# Altium schematic sheet AD9834.SchDoc
size A4
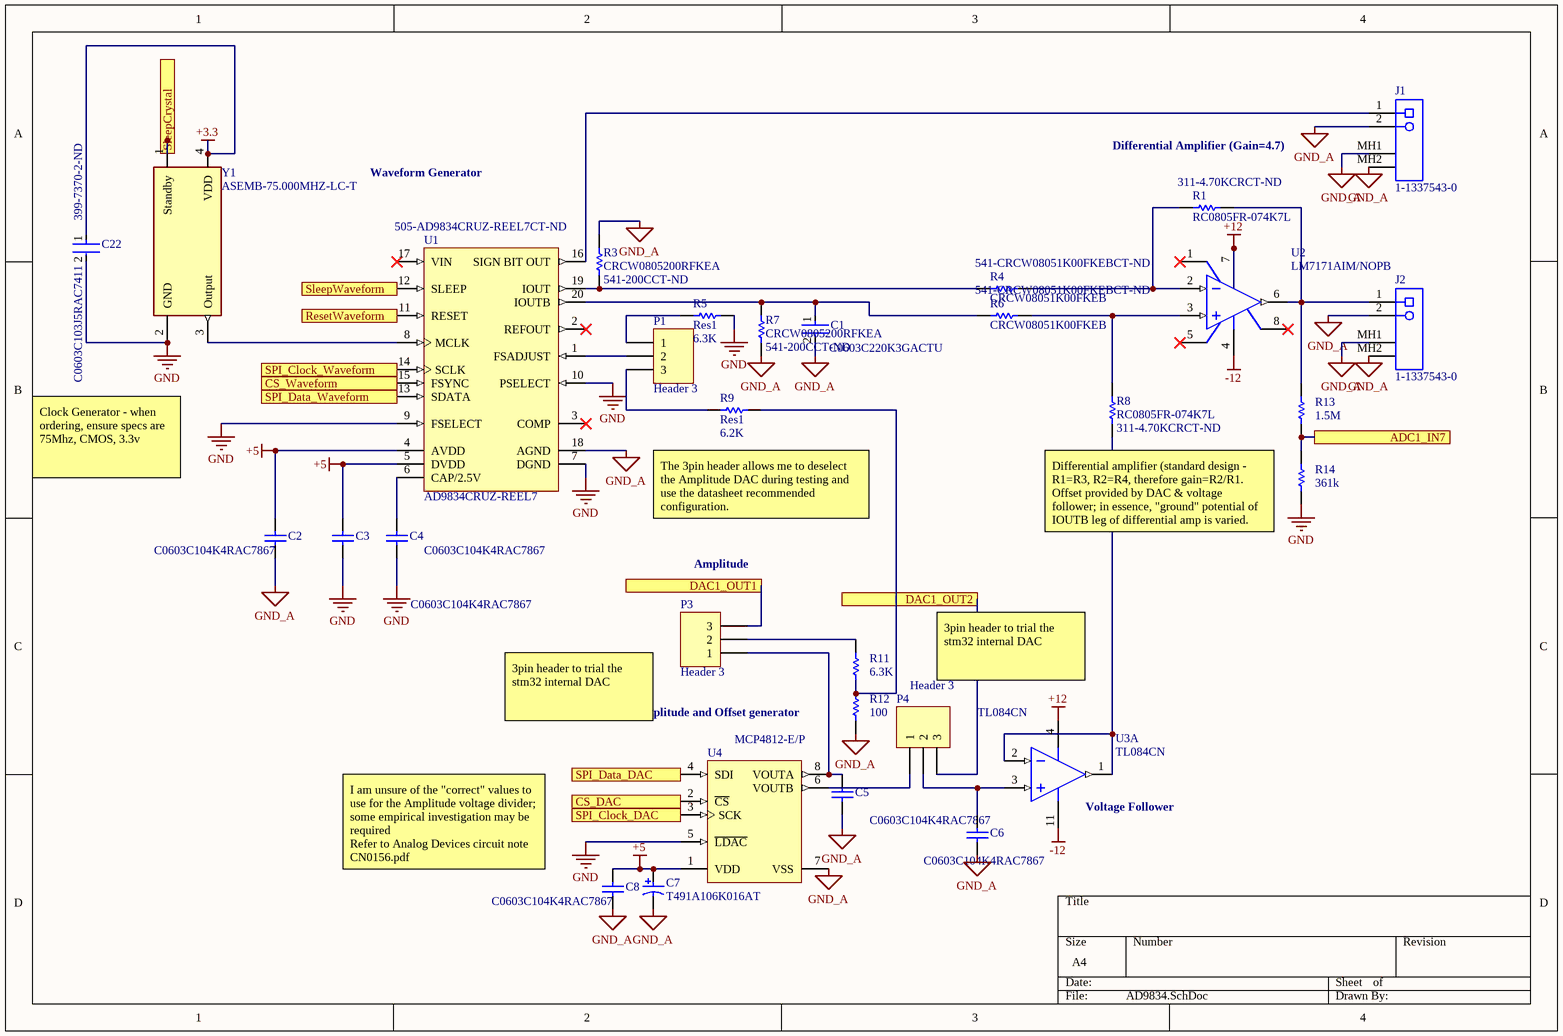
[diagram p0: AD9834.SchDoc]

## Parts
C1  C0603C220K3GACTU  [FP-C0603C-CF-MFG]
C2  C0603C104K4RAC7867  [CAPC1608X87X35NL15T15]
C3  C0603C104K4RAC7867  [CAPC1608X87X35NL15T15]
C4  C0603C104K4RAC7867  [CAPC1608X87X35NL15T15]
C5  C0603C104K4RAC7867  [CAPC1608X87X35NL15T15]
C6  C0603C104K4RAC7867  [CAPC1608X87X35NL15T15]
C7  T491A106K016AT  [KEMT-A-3216-18-2_M]
C8  C0603C104K4RAC7867  [CAPC1608X87X35NL15T15]
C22  C0603C103J5RAC7411  Supplier Part Number 1: 399-7370-2-ND  [FP-C0603C-CF-MFG]
J1  1-1337543-0  [TECO-1-1337543-0_V]
J2  1-1337543-0  [TECO-1-1337543-0_V]
P1  Header 3  [HDR1X3]
P3  Header 3  [HDR1X3]
P4  Header 3  [HDR1X3]
R1  RC0805FR-074K7L  Supplier Part Number 1: 311-4.70KCRCT-ND  [YAGO-RC0805_M]
R3  CRCW0805200RFKEA  Supplier Part Number 1: 541-200CCT-ND  [RESC2013X50X30NL20T20]
R4  CRCW08051K00FKEB  Supplier Part Number 1: 541-CRCW08051K00FKEBCT-ND  [RESC2013X50X30ML20T20]
R5  Res1  value 6.3K  [AXIAL-0.3]
R6  CRCW08051K00FKEB  Supplier Part Number 1: 541-CRCW08051K00FKEBCT-ND  [RESC2013X50X30ML20T20]
R7  CRCW0805200RFKEA  Supplier Part Number 1: 541-200CCT-ND  [RESC2013X50X30NL20T20]
R8  RC0805FR-074K7L  Supplier Part Number 1: 311-4.70KCRCT-ND  [YAGO-RC0805_M]
R9  Res1  value 6.2K  [AXIAL-0.3]
R11  value 6.3K  [AXIAL-0.3]  (hidden comment: Res11)
R12  value 100  [AXIAL-0.3]  (hidden comment: Res12)
R13  value 1.5M  [AXIAL-0.3]  (hidden comment: Res11)
R14  value 361k  [AXIAL-0.3]  (hidden comment: Res12)
U1  AD9834CRUZ-REEL7  Supplier Part Number 1: 505-AD9834CRUZ-REEL7CT-ND  [ADI-RU-20_N]
U2  LM7171AIM/NOPB  [D0008A_M]
U3  TL084CN  [N0014A]  (part A of 4)
U4  MCP4812-E/P  [PDIP300-P8]
Y1  ASEMB-75.000MHZ-LC-T  [FP-ASEMB-MFG]

## Ports
ADC1_IN7, CS_DAC, CS_Waveform, DAC1_OUT1, DAC1_OUT2, ResetWaveform, SleepCrystal, SleepWaveform, SPI_Clock_DAC, SPI_Clock_Waveform, SPI_Data_DAC, SPI_Data_Waveform

## Nets
+3.3: C22.1 Y1.4(VDD)
+5: C2.2 C3.2 C7.1 C8.2 U1.4(AVDD) U1.5(DVDD) U4.1(VDD)
+12: U2.7(V+) U3.4(VCC+)
-12: U2.4(V-) U3.11(VCC-)
GND: C3.1 C4.1 C22.2 R5.2 R14.1 U1.7(DGND) U1.9(FSELECT) U1.10(PSELECT) U4.5(~{LDAC}) Y1.2(GND)
GND_A: C1.2 C2.1 C5.1 C6.1 C7.2 C8.1 J1.2 J1.MH1 J1.MH2 J2.2 J2.MH1 J2.MH2 R3.2 R7.1 R12.1 U1.18(AGND) U4.7(VSS)
ADC1_IN7: R13.1 R14.2 ; port ADC1_IN7
CS_DAC: U4.2(~{CS}) ; port CS_DAC
CS_Waveform: U1.15(FSYNC) ; port CS_Waveform
DAC1_OUT1: P3.3 ; port DAC1_OUT1
DAC1_OUT2: P4.3 ; port DAC1_OUT2
ResetWaveform: U1.11(RESET) ; port ResetWaveform
SleepCrystal: Y1.1(Standby) ; port SleepCrystal
SleepWaveform: U1.12(SLEEP) ; port SleepWaveform
SPI_Clock_DAC: U4.3(SCK) ; port SPI_Clock_DAC
SPI_Clock_Waveform: U1.14(SCLK) ; port SPI_Clock_Waveform
SPI_Data_DAC: U4.4(SDI) ; port SPI_Data_DAC
SPI_Data_Waveform: U1.13(SDATA) ; port SPI_Data_Waveform
NetC1_1: C1.1 R6.1 R7.2 U1.20(IOUTB)
NetC4_2: C4.2 U1.6(CAP/2.5V)
NetC5_2: C5.2 P3.1 U4.8(VOUTA)
NetC6_2: C6.2 P4.2 U3.3(IN1+)
NetJ1_1: J1.1 U1.16(SIGN_BIT_OUT)
NetJ2_1: J2.1 R1.2 R13.2 U2.6(OUT)
NetP1_1: P1.1 R5.1
NetP1_2: P1.2 U1.1(FSADJUST)
NetP1_3: P1.3 R9.1
NetP3_2: P3.2 R11.2
NetP4_1: P4.1 U4.6(VOUTB)
NetR1_1: R1.1 R4.2 U2.2(IN-)
NetR3_1: R3.1 R4.1 U1.19(IOUT)
NetR6_2: R6.2 R8.2 U2.3(IN+)
NetR8_1: R8.1 U3.1(OUT1) U3.2(IN1-)
NetR9_2: R9.2 R11.1 R12.2
NetU1_8: U1.8(MCLK) Y1.3(Output)

Not connected (* = marked no-connect by the designer): U1 2(REFOUT)* 3(COMP)* 17(VIN)*; U2 1(NC)* 5(NC)* 8(NC)*

## Notes on the sheet
- Waveform Generator
- Differential Amplifier (Gain=4.7)
- Clock Generator - when ordering, ensure specs are 75Mhz, CMOS, 3.3v
- (near R9) The 3pin header allows me to deselect the Amplitude DAC during testing and use the datasheet recommended configuration.
- Amplitude
- Differential amplifier (standard design - R1=R3, R2=R4, therefore gain=R2/R1.
  Offset provided by DAC & voltage follower; in essence, "ground" potential of IOUTB leg of differential amp is varied.
- 3pin header to trial the stm32 internal DAC
- DAC - Amplitude and Offset generator
- (near U3) Voltage Follower
- I am unsure of the "correct" values to use for the Amplitude voltage divider; some empirical investigation may be required
  Refer to Analog Devices circuit note CN0156.pdf

## Library data of the parts
C1 = CMP-03020-026109-1: CAP CER 22PF 25V 10% NP0 0603; Manufacturer: KEMET; Material: Ceramic; Tolerance: 0.1; Temperature Coefficient: 30ppm/°C; Temperature Characteristic: C0G; Automotive Grade: Grade 1; Dissipation Factor: 0.1%; Device Class L1: Passive Components; Height: 0.87mm; Manufacturer Part Number: C0603C220K3GACTU; Value: 22 pF; Temperature: -55°C to +125°C; Octopart: https://octopart.com/c0603c220k3gactu-kemet-9139809; Device Class L3: Ceramic Capacitors; Voltage Rating: 25 V; Capacitance: 22 pF; Temperature Range Low: -55°C; Digikey Description: CAP CER 22PF 25V 10% NP0 0603; Mouser Description: Multilayer Ceramic Capacitors MLCC - SMD/SMT 25volts 22pF C0G 10%; Temperature Range High: +125°C; Automotive: Yes; ComponentLink2Description: Datasheet; Package: C0603C-CF; Device Class L2: Capacitors; Category: Cap; RoHS: TRUE; Lead Free: Yes; ComponentLink2URL: https://api.kemet.com/component-edge/download/datasheet/C0603C100J5GACAUTO.pdf; Stock 1: 72525; Pricing 1: 1=0.10000, 10=0.07500, 50=0.04060, 100=0.03320, 500=0.02372, 1000=0.01863 (USD); Mount: Surface Mount; Case/Package: 0603; Dielectric Material: Ceramic; Case Code (Metric): 1608; Case Code (Imperial): 0603; Contact Plating: Tin,Matte; Min Operating Temperature: -55°C; Max Operating Temperature: 125°C; Packaging: Tape and Reel; Voltage Rating (DC): 25V; Dielectric: C0G; Package Quantity: 4000; Termination: SMD/SMT; Length: 1.6mm; Width: 0.031inch; Thickness: 0.034inch; Depth: 0.8mm; Lead Pitch: 0.7mm; ComponentLink1URL: https://datasheet.ciiva.com/5413/kem-c1003-c0g-smd-356956-5413159.pdf?src-supplier=Mouser; ComponentLink1Description: https://datasheet.ciiva.com/5413/kem-c1003-c0g-smd-356956-5413159.pdf?src-supplier=Mouser
C2 C5 C6 C8 = CMP-2006-03811-1: 0.1uF Ceramic; Manufacturer: Kemet; Capacitance: 100nF; Voltage Rating: 16V; Tolerance: 10%; Dielectric: X7R; Dissipation Factor: 3.5%; Part Number: C0603C104K4RAC7867; RoHS: Yes; Category: Ceramic Capacitors; Stock 1: 2000839; Pricing 1: 1=0.12000, 10=0.08700, 50=0.04720, 100=0.03850, 500=0.02752, 1000=0.02163 (USD); Mount: Surface Mount,PCB; Case/Package: 0603; Number of Pins: 2; Case Code (Metric): 1608; Case Code (Imperial): 0603; Dielectric Material: Ceramic; Contact Plating: Tin,Matte; Min Operating Temperature: -55°C; Max Operating Temperature: 125°C; Package Quantity: 4000; Packaging: Tape and Reel; Voltage Rating (DC): 16V; Termination: SMD/SMT; Voltage: 16V; Length: 1.6mm; Height: 0.8mm; Width: 0.8mm; Thickness: 0.034inch; Depth: 0.8mm; Lead Pitch: 0.7mm; Radiation Hardening: No; REACH SVHC: No SVHC; ComponentLink1URL: https://datasheet.ciiva.com/14589/70095383-14589014.pdf?src-supplier=Allied+Electronics; ComponentLink1Description: https://datasheet.ciiva.com/14589/70095383-14589014.pdf?src-supplier=Allied+Electronics; ComponentLink2URL: https://datasheet.ciiva.com/18192/getdatasheetpartid-330584-18192695.pdf?src-supplier=Verical; ComponentLink2Description: https://datasheet.ciiva.com/18192/getdatasheetpartid-330584-18192695.pdf?src-supplier=Verical; ComponentLink3URL: https://datasheet.ciiva.com/22749/kem-c1002-x7r-smd-22749657.pdf?src-supplier=Element14; ComponentLink3Description: https://datasheet.ciiva.com/22749/kem-c1002-x7r-smd-22749657.pdf?src-supplier=Element14; ComponentLink4URL: https://datasheet.ciiva.com/5413/kem-c1002-x7r-smd-5413791.pdf?src-supplier=Mouser; ComponentLink4Description: https://datasheet.ciiva.com/5413/kem-c1002-x7r-smd-5413791.pdf?src-supplier=Mouser
C3 C4 = CMP-2006-03811-1: Manufacturer: Kemet; Dielectric Material: Ceramic; Capacitance: 100nF; Voltage Rating: 16V; Tolerance: 10%; Dielectric: X7R; Dissipation Factor: 3.5%; Part Number: C0603C104K4RAC7867; RoHS: Yes; Category: Ceramic Capacitors; Stock 1: 2000839; Pricing 1: 1=0.12000, 10=0.08700, 50=0.04720, 100=0.03850, 500=0.02752, 1000=0.02163 (USD); Mount: Surface Mount,PCB; Case/Package: 0603; Number of Pins: 2; Case Code (Metric): 1608; Case Code (Imperial): 0603; Contact Plating: Tin,Matte; Min Operating Temperature: -55°C; Max Operating Temperature: 125°C; Package Quantity: 4000; Packaging: Tape and Reel; Voltage Rating (DC): 16V; Termination: SMD/SMT; Voltage: 16V; Length: 1.6mm; Height: 0.8mm; Width: 0.8mm; Thickness: 0.034inch; Depth: 0.8mm; Lead Pitch: 0.7mm; Radiation Hardening: No; REACH SVHC: No SVHC; ComponentLink1URL: https://datasheet.ciiva.com/14589/70095383-14589014.pdf?src-supplier=Allied+Electronics; ComponentLink1Description: https://datasheet.ciiva.com/14589/70095383-14589014.pdf?src-supplier=Allied+Electronics; ComponentLink2URL: https://datasheet.ciiva.com/18192/getdatasheetpartid-330584-18192695.pdf?src-supplier=Verical; ComponentLink2Description: https://datasheet.ciiva.com/18192/getdatasheetpartid-330584-18192695.pdf?src-supplier=Verical; ComponentLink3URL: https://datasheet.ciiva.com/22749/kem-c1002-x7r-smd-22749657.pdf?src-supplier=Element14; ComponentLink3Description: https://datasheet.ciiva.com/22749/kem-c1002-x7r-smd-22749657.pdf?src-supplier=Element14; ComponentLink4URL: https://datasheet.ciiva.com/5413/kem-c1002-x7r-smd-5413791.pdf?src-supplier=Mouser; ComponentLink4Description: https://datasheet.ciiva.com/5413/kem-c1002-x7r-smd-5413791.pdf?src-supplier=Mouser
C7 = CMP-2000-05173-1: Capacitor, Tantalum, 10 uF, +/- 10%, 16 V, -55 to 125 degC, 2-Pin SMD (1206), RoHS, Tape and Reel; Manufacturer: Kemet; Insulation: NotRequired; Voltage: 16VDC; Capacitance: 10uF; Product Height (mm): 1.6mm; Polarity: Polar; Lead Spacing (nom): NotRequiredmm; Product Length (mm): 3.2mm; Case Style: Molded; DCL: 1.6uA; ESR: 7ohm; DF: 8%; Mounting Style: SurfaceMount; Manufacturer URL: http://www.kemet.com/; Datasheet Version: Apr-14; Package Description: 2-Pin Surface Mount Device, Body 3.2 x 1.6 mm; Operating Temp Range: -55Cto125C; Package Reference: 1206; Wire Form: NotRequired; Datasheet URL: http://www.farnell.com/datasheets/1824869.pdf; Tolerance (+ or -): 10%; Failure Rate: NotRequired; Length W/Weld: NotRequiredmm; Package / Case: 3216-18; Seated Plane Height: NotRequiredmm; Product Diameter (mm): NotRequiredmm; Construction: SMTChip; Seal: NotRequired; Case Code: A; Product Depth (mm): 1.6mm; Packaging: TapeandReel
C22 = CMP-03020-011072-1: CAP CER 10000PF 50V X7R 0603; Manufacturer: KEMET; Value: 10,000 pF; Tolerance: 0.05; Automotive Grade: Grade 1; Material: Ceramic; Temperature Coefficient: 30ppm/°C; Dissipation Factor: 2.5%; Lead Free: Yes; Voltage Rating: 50 V; Temperature: -55°C to +125°C; Digikey Description: CAP CER 10000PF 50V X7R 0603; Device Class L2: Capacitors; Package: C0603C-CF; Device Class L3: Ceramic Capacitors; Height: 0.87mm; ComponentLink2Description: Datasheet; Temperature Range High: +125°C; Capacitance: 10,000 pF; Octopart: https://octopart.com/c0603c103j5rac7411-kemet-3901156; ComponentLink2URL: https://api.kemet.com/component-edge/download/datasheet/C0603C100J5GACAUTO.pdf; Category: Cap; Automotive: Yes; Temperature Range Low: -55°C; Mouser Description: Cap Ceramic 0.01uF 50V X7R 5% SMD 0603 125°C Punched Paper T/R; Temperature Characteristic: X7R; RoHS: TRUE; Manufacturer Part Number: C0603C103J5RAC7411; Device Class L1: Passive Components; Supplier 1: Digi-Key; Stock 1: 15000; Pricing 1: 15000=0.00836, 30000=0.00794, 75000=0.00711 (USD); Mount: Surface Mount; Case/Package: 0603; Case Code (Metric): 1608; Case Code (Imperial): 0603; Dielectric Material: Ceramic; Min Operating Temperature: -55°C; Max Operating Temperature: 125°C; Packaging: Tape and Reel; Voltage Rating (DC): 50V; Dielectric: X7R; Package Quantity: 15000; Termination: SMD/SMT; Length: 1.6mm; Width: 0.031inch; Depth: 0.8mm; Thickness: 0.035inch; Lead Pitch: 0.7mm; ComponentLink1URL: https://datasheet.ciiva.com/5411/kem-c1002-x7r-smd-357932-5411286.pdf?src-supplier=Mouser; ComponentLink1Description: https://datasheet.ciiva.com/5411/kem-c1002-x7r-smd-357932-5411286.pdf?src-supplier=Mouser
J1 J2 = CMP-2000-05853-1: Female Connector, Pitch 2.54 mm, 1 x 2 Position, Height 15.8 mm, Tail Length 3.8 mm, / -55 to 85 degC, RoHS, Bulk; Manufacturer: TE Connectivity; Connector Body Style: RightAngleJack; Frequency Max: 4GHz; Coaxial Termination: Solder; Connector Mounting: PCBMount; SVHC: ToBeAdvised; Connector Type: BNCCoaxial; Impedance: 50ohm; Body Plating: Nickel; Dielectric Material: PE; Polarity: Normal; Number of Positions: 1; PCB Mount Retention: With; Sealable: No (Without); Connector System: Cable-to-Board; Tail Length: 4.9mm; PCB Thickness: 0.13inch; Coaxial Cable Types: -; Manufacturer URL: http://www.te.com/; Package Reference: 1-1337543-0; Product Range: -; Datasheet URL: http://www.te.com/commerce/DocumentDelivery/DDEController?Action=showdoc&DocId=Customer+Drawing%7F1337543%7FG%7Fpdf%7FEnglish%7FENG_CD_1337543_G.pdf%7F1-1337543-0; Contact Plating: GoldPlatedContacts; Mounting Technology: ThroughHole; Package Description: Female Connector, Pitch 2.54 mm, 1 x 2 Position, Height 15.8 mm, Tail Length 3.8 mm; Contact Material: Brass; Datasheet Version: Rev. G, 12/2012; RoHS: Yes; Category: RF / Coaxial Connectors; Stock 1: 5804; Pricing 1: 1=1.67000, 10=1.51400, 25=1.42120, 50=1.35920, 100=1.29750, 250=1.17388, 500=1.08122, 1000=0.92676 (USD); Housing Color: White; Insulation Material: Polyethylene; Plating: Nickel; Color: White; Min Operating Temperature: -67°C; Max Operating Temperature: 185°C; Packaging: Box; Package Quantity: 100; Termination: Solder; Gender: Female; Fastening Type: Bayonet; Max Frequency: 4GHz; Orientation: Right Angle; Frequency: 4GHz; Length: 14.7mm; Depth: 34.9mm; Radiation Hardening: No; REACH SVHC: Unknown; ComponentLink1URL: https://datasheet.ciiva.com/644/eng-cd-1337543-g-644734.pdf?src-supplier=Farnell; ComponentLink1Description: https://datasheet.ciiva.com/644/eng-cd-1337543-g-644734.pdf?src-supplier=Farnell; ComponentLink2URL: https://datasheet.ciiva.com/644/eng-cd-1337543-g-644734.pdf?src-supplier=Digi-Key; ComponentLink2Description: https://datasheet.ciiva.com/644/eng-cd-1337543-g-644734.pdf?src-supplier=Digi-Key; ComponentLink3URL: https://datasheet.ciiva.com/11763/0900766b805faaaa-11763772.pdf?src-supplier=RSComponents; ComponentLink3Description: https://datasheet.ciiva.com/11763/0900766b805faaaa-11763772.pdf?src-supplier=RSComponents; ComponentLink4URL: https://datasheet.ciiva.com/1115/580087-1115285.pdf?src-supplier=Element14; ComponentLink4Description: https://datasheet.ciiva.com/1115/580087-1115285.pdf?src-supplier=Element14; ComponentLink5URL: https://datasheet.ciiva.com/14567/70084602-14567445.pdf?src-supplier=Allied+Electronics; ComponentLink5Description: https://datasheet.ciiva.com/14567/70084602-14567445.pdf?src-supplier=Allied+Electronics; ComponentLink6URL: https://datasheet.ciiva.com/3133/eng-ds-6-1773448-5-zdc-rf-coax-50-75-ohm-1007-3133303.pdf?src-supplier=Avnet; ComponentLink6Description: https://datasheet.ciiva.com/3133/eng-ds-6-1773448-5-zdc-rf-coax-50-75-ohm-1007-3133303.pdf?src-supplier=Avnet; ComponentLink7URL: https://datasheet.ciiva.com/16653/eng-ds-6-1773448-5-zdc-rf-coax-50-75-ohm-1007-16653071.pdf?src-supplier=Avnet+Europe; ComponentLink7Description: https://datasheet.ciiva.com/16653/eng-ds-6-1773448-5-zdc-rf-coax-50-75-ohm-1007-16653071.pdf?src-supplier=Avnet+Europe; ComponentLink8URL: https://datasheet.ciiva.com/30238/eng-ds-6-1773448-5-zdc-rf-coax-50-75-ohm-1007-30238783.pdf?src-supplier=Onlinecomponents.com; ComponentLink8Description: https://datasheet.ciiva.com/30238/eng-ds-6-1773448-5-zdc-rf-coax-50-75-ohm-1007-30238783.pdf?src-supplier=Onlinecomponents.com
P1 P3 P4 = Header 3: Header, 3-Pin; LatestRevisionDate: 17-Jul-2002; LatestRevisionNote: Re-released for DXP Platform.; Publisher: Altium Limited
R1 R8 = CMP-1568-00001-1: General Puprose Chip Resistor, 4700 Ohm +/- 1%, 0.125 W, -55 to 155 degC, 2-Pin SMD, RoHS, Tape and Reel; Manufacturer: Yageo; Tolerance: +/- 1%; Power: 0.125 W; Temperature Coefficient: 100ppm/°C; Power Rating: 125mW; Voltage Rating: 150V; PackageDescription: 2-Pin Surface Mount Device, Body 2 x 1.25 mm; ComponentLink2URL: http://www.yageo.com/documents/recent/PYu-RC_Group_51_RoHS_L-3.pdf; Temperature Min: -55 degC; Packing: Tape and Reel; Mounting Technology: Surface Mount; PartNumber: RC0805FR-074K7L; ComponentLink1URL: http://www.yageo.com/NewPortal/_en/index.jsp; Resistance: 4700 Ohm; Temperature Max: 155 degC; ComponentLink2Description: Datasheet; DatasheetVersion: Rev. 3; RoHS: TRUE; ComponentLink1Description: Manufacturer URL; Supplier 1: Digi-Key; Manufacturer Part Number: RC0805FR-074K7L; Category: Chip SMD Resistors; Stock 1: 2280022; Pricing 1: 1=0.10000, 10=0.03900, 100=0.01570, 1000=0.00705, 2500=0.00612 (USD); Case/Package: 0805; Number of Pins: 2; Case Code (Metric): 2012; Case Code (Imperial): 0805; Min Operating Temperature: -55°C; Max Operating Temperature: 155°C; Packaging: Tape and Reel; Composition: Thick Film; Voltage Rating (DC): 150V; Termination: SMD/SMT; Number of Terminations: 2; Max Power Dissipation: 125mW; Package Quantity: 5000; Military Standard: Not; Features: Moisture Resistant; Length: 0.079inch; Height: 0.024inch; Width: 0.049inch; Depth: 1.25mm; Lead Free: Lead Free; REACH SVHC: No SVHC; ComponentLink3URL: https://datasheet.ciiva.com/11808/0900766b8106beab-11808155.pdf?src-supplier=RSComponents; ComponentLink3Description: https://datasheet.ciiva.com/11808/0900766b8106beab-11808155.pdf?src-supplier=RSComponents; ComponentLink4URL: https://datasheet.ciiva.com/7941/444164-7941804.pdf?src-supplier=Element14; ComponentLink4Description: https://datasheet.ciiva.com/7941/444164-7941804.pdf?src-supplier=Element14; ComponentLink5URL: https://datasheet.ciiva.com/7941/1686128-7941805.pdf?src-supplier=Element14; ComponentLink5Description: https://datasheet.ciiva.com/7941/1686128-7941805.pdf?src-supplier=Element14; ComponentLink6URL: https://datasheet.ciiva.com/7941/444164-7941806.pdf?src-supplier=Element14; ComponentLink6Description: https://datasheet.ciiva.com/7941/444164-7941806.pdf?src-supplier=Element14; ComponentLink7URL: https://datasheet.ciiva.com/6547/pyu-r-int-thick-7-6547263.pdf?src-supplier=Digi-Key; ComponentLink7Description: https://datasheet.ciiva.com/6547/pyu-r-int-thick-7-6547263.pdf?src-supplier=Digi-Key; ComponentLink8URL: https://datasheet.ciiva.com/46447/444164-46447583.pdf?src-supplier=Element14; ComponentLink8Description: https://datasheet.ciiva.com/46447/444164-46447583.pdf?src-supplier=Element14
R3 R7 = CMP-2001-03663-1: Manufacturer: Vishay Dale; Resistance: 200R; Tolerance: 1%; Temperature Coefficient: 100ppm/°C; Power Rating: 125mW; Voltage Rating: 150V; Part Number: CRCW0805200RFKEA; Supplier 1: Digi-Key; Manufacturer Part Number: CRCW0805200RFKEA; RoHS: Yes; Category: Chip SMD Resistors; Stock 1: 97163; Pricing 1: 1=0.10000, 10=0.06000, 100=0.02450, 1000=0.01102, 2500=0.00957 (USD); Mount: Surface Mount; Case/Package: 0805; Number of Pins: 2; Weight: 0.000194oz; Case Code (Metric): 2012; Case Code (Imperial): 0805; Contact Plating: Tin; Min Operating Temperature: -55°C; Max Operating Temperature: 155°C; Packaging: Tape and Reel; Termination: SMD/SMT; Composition: Thick Film; Voltage Rating (DC): 150V; Package Quantity: 10; Number of Terminations: 2; Military Standard: Not; Max Power Dissipation: 125mW; Features: Automotive AEC-Q200; Working Voltage: 150V; Length: 2mm; Height: 0.45mm; Width: 0.049inch; Depth: 1.25mm; Radiation Hardening: No; REACH SVHC: Unknown; Lead Free: Lead Free; ComponentLink1URL: https://datasheet.ciiva.com/11809/0900766b80d98b26-11809981.pdf?src-supplier=RSComponents; ComponentLink1Description: https://datasheet.ciiva.com/11809/0900766b80d98b26-11809981.pdf?src-supplier=RSComponents; ComponentLink2URL: https://datasheet.ciiva.com/2467/dcrcwe3-2467524.pdf?src-supplier=Digi-Key; ComponentLink2Description: https://datasheet.ciiva.com/2467/dcrcwe3-2467524.pdf?src-supplier=Digi-Key; ComponentLink3URL: https://datasheet.ciiva.com/2467/dcrcwe3-2467525.pdf?src-supplier=Digi-Key; ComponentLink3Description: https://datasheet.ciiva.com/2467/dcrcwe3-2467525.pdf?src-supplier=Digi-Key; ComponentLink4URL: https://datasheet.ciiva.com/17167/dcrcwe3-17167157.pdf?src-supplier=Avnet+Europe; ComponentLink4Description: https://datasheet.ciiva.com/17167/dcrcwe3-17167157.pdf?src-supplier=Avnet+Europe; ComponentLink5URL: https://datasheet.ciiva.com/2467/dcrcwe3-2467526.pdf?src-supplier=Digi-Key; ComponentLink5Description: https://datasheet.ciiva.com/2467/dcrcwe3-2467526.pdf?src-supplier=Digi-Key; ComponentLink6URL: https://datasheet.ciiva.com/7673/1697337-7673478.pdf?src-supplier=Element14; ComponentLink6Description: https://datasheet.ciiva.com/7673/1697337-7673478.pdf?src-supplier=Element14; ComponentLink7URL: https://datasheet.ciiva.com/16755/70201119-16755607.pdf?src-supplier=Allied+Electronics; ComponentLink7Description: https://datasheet.ciiva.com/16755/70201119-16755607.pdf?src-supplier=Allied+Electronics; ComponentLink8URL: https://datasheet.ciiva.com/7673/1697337-7673336.pdf?src-supplier=Element14; ComponentLink8Description: https://datasheet.ciiva.com/7673/1697337-7673336.pdf?src-supplier=Element14; ComponentLink9URL: https://datasheet.ciiva.com/5542/dcrcwe3-109170-5542762.pdf?src-supplier=Mouser; ComponentLink9Description: https://datasheet.ciiva.com/5542/dcrcwe3-109170-5542762.pdf?src-supplier=Mouser; ComponentLink10URL: https://datasheet.ciiva.com/26317/fld-crcw-e3-data-en-26317339.pdf?src-supplier=Distrelec; ComponentLink10Description: https://datasheet.ciiva.com/26317/fld-crcw-e3-data-en-26317339.pdf?src-supplier=Distrelec; ComponentLink11URL: https://datasheet.ciiva.com/3258/dcrcwe3-3258302.pdf?src-supplier=Avnet; ComponentLink11Description: https://datasheet.ciiva.com/3258/dcrcwe3-3258302.pdf?src-supplier=Avnet; ComponentLink12URL: https://datasheet.ciiva.com/16199/dcrcwe3-16199471.pdf?src-supplier=Future+Electronics; ComponentLink12Description: https://datasheet.ciiva.com/16199/dcrcwe3-16199471.pdf?src-supplier=Future+Electronics; ComponentLink13URL: https://datasheet.ciiva.com/16786/70201119-16786975.pdf?src-supplier=Allied+Electronics; ComponentLink13Description: https://datasheet.ciiva.com/16786/70201119-16786975.pdf?src-supplier=Allied+Electronics
R4 R6 = CMP-2001-03596-1: Manufacturer: Vishay Dale; Tolerance: 1%; Resistance: 1kR; Power Rating: 125mW; Voltage Rating: 150V; Temperature Coefficient: 100ppm/°C; Part Number: CRCW08051K00FKEB; Supplier 1: Digi-Key; Manufacturer Part Number: CRCW08051K00FKEB; RoHS: Yes; Category: Chip SMD Resistors; Stock 1: 1; Pricing 1: 1=0.10000, 10=0.06000, 100=0.02450, 1000=0.01102, 2500=0.00957, 5000=0.00790 (USD); Case/Package: 0805; Number of Pins: 2; Weight: 0.000194oz; Case Code (Imperial): 0805; Case Code (Metric): 2012; Contact Plating: Tin; Min Operating Temperature: -55°C; Max Operating Temperature: 155°C; Packaging: Tape and Reel; Composition: Thick Film; Termination: SMD/SMT; Voltage Rating (DC): 150V; Package Quantity: 10000; Military Standard: Not; Number of Terminations: 2; Max Power Dissipation: 125mW; Features: Automotive AEC-Q200; Length: 2mm; Height: 0.02inch; Width: 1.25mm; Depth: 1.25mm; Radiation Hardening: No; REACH SVHC: Unknown; Lead Free: Lead Free; ComponentLink1URL: https://datasheet.ciiva.com/5548/dcrcwe3-109170-5548552.pdf?src-supplier=Mouser; ComponentLink1Description: https://datasheet.ciiva.com/5548/dcrcwe3-109170-5548552.pdf?src-supplier=Mouser; ComponentLink2URL: https://datasheet.ciiva.com/7725/1847332-7725820.pdf?src-supplier=Element14; ComponentLink2Description: https://datasheet.ciiva.com/7725/1847332-7725820.pdf?src-supplier=Element14; ComponentLink3URL: https://datasheet.ciiva.com/9112/dcrcwe3-9112206.pdf?src-supplier=Avnet; ComponentLink3Description: https://datasheet.ciiva.com/9112/dcrcwe3-9112206.pdf?src-supplier=Avnet; ComponentLink4URL: https://datasheet.ciiva.com/46391/1807946-46391934.pdf?src-supplier=Element14; ComponentLink4Description: https://datasheet.ciiva.com/46391/1807946-46391934.pdf?src-supplier=Element14
R5 R9 R11-R14 = Res1: Resistor; Published: 8-Jun-2000; LatestRevisionDate: 17-Jul-2002; LatestRevisionNote: Re-released for DXP Platform.; PackageReference: AXIAL-0.3; Publisher: Altium Limited; PackageDescription: Axial Device, Thru-Hole; 2 Leads; 0.3 in Pin Spacing
U1 = CMP-0293-00051-1: 20 mW Power, 2.3 V to 5.5 V, 75 MHz Complete DDS, 10-Bit, Serial, RU-20, 1000 Reel, Pb-Free; Manufacturer: Analog Devices; Master fclk: 75MHz; REFCLK Multiplier: No; Tuning Word Width (bits): 28bit; Resolution (Bits): 10bit; I Supply total (max): 8.7mA; Compliance Range (V): 800mV; FS Iout (mA nom): 3mA; Min Supply Voltage: 2.3V; Max Supply Voltage: 5.5V; Resolution: 10b; Number of Converters: 1; Signal to Noise Ratio (SNR): 60dB; Power Dissipation: 40mW; Number of Bits: 10; Max Supply Current: 5mA; Nominal Output Voltage: 600mV; DatasheetVersion: Rev. C; PackageVersion: 2000; ComponentLink3URL: http://www.analog.com/static/imported-files/packages/364515793657813558433715854054607941441RU20.pdf; ComponentLink1Description: Manufacturer URL; PackageDescription: 20-Lead Thin Shrink Small Outline Package [TSSOP]; ComponentLink2URL: http://www.analog.com/static/imported-files/data_sheets/AD9834.pdf; ComponentLink2Description: Datasheet; ComponentLink3Description: Package Specification; Code_JEDEC: MO-153AC; PackageReference: RU-20; ComponentLink1URL: www.analog.com; I/O Interface: Serial; Supplier 1: Digi-Key; Manufacturer Part Number: AD9834CRUZ-REEL7; RoHS: Yes; Category: Integrated Circuits (ICs); Stock 1: 1285; Pricing 1: 1=12.89000, 10=11.85000, 25=11.35920, 100=10.00820, 250=9.51700, 500=8.90300 (USD); Mount: Surface Mount; Case/Package: TSSOP; Number of Pins: 20; Contact Plating: Tin,Matte; Min Operating Temperature: -40°C; Max Operating Temperature: 105°C; Package Quantity: 1000; Packaging: Tape and Reel; Nominal Supply Current: 8.7mA; Number of D/A Converters: 1; Number of Outputs: 1; Frequency: 75MHz; Operating Supply Current: 8.7mA; Lead Free: Contains Lead; ComponentLink4URL: https://datasheet.ciiva.com/26828/ad9834cruz-reel7-26828141.pdf?src-supplier=IIIC; ComponentLink4Description: https://datasheet.ciiva.com/26828/ad9834cruz-reel7-26828141.pdf?src-supplier=IIIC; ComponentLink5URL: https://datasheet.ciiva.com/25889/ad9834-25889590.pdf?src-supplier=Avnet+Europe; ComponentLink5Description: https://datasheet.ciiva.com/25889/ad9834-25889590.pdf?src-supplier=Avnet+Europe
U2 = CMP-0055-00653-3: Very High Speed, High Output Current, Voltage Feedback Amplifier, 8-pin Narrow SOIC, Pb-Free; Manufacturer: Texas Instruments; PackageTopMarking: NSZXTT*LM71*71AIM; CompType: Amplifiers; PowerWise: N; Output Current: 100mA; Max Supply Voltage: 36V; Min Supply Voltage: 5.5V; Slew Rate: 4100V/µs; Common Mode Rejection Ratio: 80dB; Min Dual Supply Voltage: 2.75V; Max Dual Supply Voltage: 18V; Voltage Gain: 78dB; Number of Channels: 1; Input Offset Voltage (Vos): 200uV; Input Bias Current: 10uA; Gain Bandwidth Product: 200MHz; Output Current per Channel: 118mA; Nominal Supply Current: 6.5mA; Unity Gain Bandwidth Product: 125MHz; Power Supply Rejection Ratio (PSRR): 85dB; Dual Supply Voltage: 9V; -3db Bandwidth: 220MHz; Max Supply Current: 8mA; Code_IPC: SOIC127P600-8; Code_JEDEC: MS-012-AA; ComponentLink1URL: http://www.ti.com/general/docs/lit/getliterature.tsp?genericPartNumber=LM7171&fileType=pdf; RoHS: Y; PackageDescription: SOIC Narrow, 4.9 x 3.9 x 1.45mm, 8 Lead, 1.27mm Pitch; ComponentLink1Description: Datasheet URL; Package Reference: D0008A; PinCount: 8; Category: Amplifiers - Op Amps, Buffer, Instrumentation; Stock 1: 1065; Pricing 1: 1=4.25000, 10=3.81300, 25=3.60440, 100=2.96370, 250=2.65932, 500=2.56320, 1000=2.13066 (USD); Mount: Surface Mount; Case/Package: SOIC; Number of Pins: 8; Contact Plating: Tin,Matte; Min Operating Temperature: -40°C; Max Operating Temperature: 85°C; Packaging: Rail/Tube; Package Quantity: 95; Number of Circuits: 1; Operating Supply Current: 6.5mA; Number of Elements: 1; Operating Supply Voltage: 18V; Bandwidth: 200MHz; Number of Amplifiers: 1; Length: 4.9mm; Height: 1.45mm; Width: 3.9mm; Radiation Hardening: No; Lead Free: Lead Free; REACH SVHC: No SVHC; ComponentLink2URL: https://datasheet.ciiva.com/15130/getdatasheetpartid-88592-15130434.pdf?src-supplier=Verical; ComponentLink2Description: https://datasheet.ciiva.com/15130/getdatasheetpartid-88592-15130434.pdf?src-supplier=Verical; ComponentLink3URL: https://datasheet.ciiva.com/19465/1302289-19465118.pdf?src-supplier=Jameco; ComponentLink3Description: https://datasheet.ciiva.com/19465/1302289-19465118.pdf?src-supplier=Jameco; ComponentLink4URL: https://datasheet.ciiva.com/6626/lm7171-6626629.pdf?src-supplier=Digi-Key; ComponentLink4Description: https://datasheet.ciiva.com/6626/lm7171-6626629.pdf?src-supplier=Digi-Key; ComponentLink5URL: https://datasheet.ciiva.com/2973/lm7171-2973433.pdf?src-supplier=Avnet; ComponentLink5Description: https://datasheet.ciiva.com/2973/lm7171-2973433.pdf?src-supplier=Avnet; ComponentLink6URL: https://datasheet.ciiva.com/8008/1902708-8008895.pdf?src-supplier=Element14; ComponentLink6Description: https://datasheet.ciiva.com/8008/1902708-8008895.pdf?src-supplier=Element14
U3 = CMP-0017-00818-2: JFET-Input Operational Amplifier, 7 to 36 V, 0 to 70 degC, 14-pin DIP (N14), Pb-Free (RoHS); Manufacturer: Texas Instruments; Rating: Catalog; Iq per channel(Max)(mA): 2.8; Number of Channels: 4; IIB(Max)(pA): 400; Vio (25C)(Max)(mV): 15; GBW(Typ)(MHz): 3; Total Supply Voltage(Max)(+5V is 5, +/-5V is 10): 36; Vn at 1kHz(Typ)(nV/rtHz): 18; Sub Family: General Purpose Amplifier, High Supply Voltage Amplifier (>=30V); Slew Rate(Typ)(V/us): 13; Total Supply Voltage(Min)(+5V is 5, +/-5V is 10): 7; CMRR(Min)(dB): 70; Voltage Gain: 106.02dB; Unity Gain Bandwidth Product: 3MHz; Min Dual Supply Voltage: 3.5V; Max Dual Supply Voltage: 18V; Common Mode Rejection Ratio: 70dB; Slew Rate: 13V/µs; Input Offset Voltage (Vos): 15mV; Input Bias Current: 400pA; Operating Supply Current: 1.4mA; Nominal Supply Current: 11.2mA; Dual Supply Voltage: 9V; Max Power Dissipation: 680mW; ComponentLink3Description: Package Specification; PackageDescription: 14-Pin Plastic In-Line, Body 19.305 x 6.35 mm, Pitch 2.54 mm; ComponentLink1Description: Manufacturer URL; PackageVersion: 4040049/E, 12/2002; Eco-Plan: Pb-Free (RoHS); ComponentLink2URL: http://www.ti.com/lit/ds/symlink/tl084.pdf; ComponentLink1URL: http://www.ti.com/; DatasheetVersion: SLOS081G; Mounting Technology: Through Hole; PartNumber: TL084CN; Offset Drift(Typ)(uV/C): 18; PackageReference: N0014A; ComponentLink3URL: http://www.ti.com/lit/ml/mpdi002c/mpdi002c.pdf; ComponentLink2Description: Datasheet; Code_JEDEC: MS-001; Manufacturer Part Number: TL084CN; RoHS: Yes; Category: Amplifiers - Op Amps, Buffer, Instrumentation; Stock 1: 8967; Pricing 1: 1=0.55000, 10=0.46900, 25=0.43760, 100=0.32500, 250=0.27500, 500=0.26250, 1000=0.19375, 2500=0.18125, 5000=0.16875 (USD); Case/Package: N; Number of Pins: 14; Contact Plating: Gold; Min Operating Temperature: -40°C; Max Operating Temperature: 125°C; Packaging: Rail/Tube; Gain Bandwidth Product: 3MHz; Number of Elements: 4; Package Quantity: 25; Number of Circuits: 4; Bandwidth: 3MHz; Max I/O Voltage: 15mV; Nominal Gain Bandwidth Product: 3MHz; Max Supply Voltage: 18V; Number of Amplifiers: 4; Length: 19.3mm; Height: 4.57mm; Width: 6.35mm; Radiation Hardening: No; Lead Free: Lead Free; REACH SVHC: No SVHC; ComponentLink4URL: https://datasheet.ciiva.com/15129/getdatasheetpartid-40651-15129703.pdf?src-supplier=Verical; ComponentLink4Description: https://datasheet.ciiva.com/15129/getdatasheetpartid-40651-15129703.pdf?src-supplier=Verical; ComponentLink5URL: https://datasheet.ciiva.com/25628/0900766b800212d0-25628999.pdf?src-supplier=RSComponents; ComponentLink5Description: https://datasheet.ciiva.com/25628/0900766b800212d0-25628999.pdf?src-supplier=RSComponents; ComponentLink6URL: https://datasheet.ciiva.com/14151/tl081-tl084-eng-tds-14151110.pdf?src-supplier=Distrelec; ComponentLink6Description: https://datasheet.ciiva.com/14151/tl081-tl084-eng-tds-14151110.pdf?src-supplier=Distrelec; ComponentLink7URL: https://datasheet.ciiva.com/1796/tl081a-1796122.pdf?src-supplier=Digi-Key; ComponentLink7Description: https://datasheet.ciiva.com/1796/tl081a-1796122.pdf?src-supplier=Digi-Key; ComponentLink8URL: https://datasheet.ciiva.com/26243/tl082-26243803.pdf?src-supplier=Avnet+Europe; ComponentLink8Description: https://datasheet.ciiva.com/26243/tl082-26243803.pdf?src-supplier=Avnet+Europe; ComponentLink9URL: https://datasheet.ciiva.com/7709/1846992-7709948.pdf?src-supplier=Element14; ComponentLink9Description: https://datasheet.ciiva.com/7709/1846992-7709948.pdf?src-supplier=Element14; ComponentLink10URL: https://datasheet.ciiva.com/7709/94128-7709949.pdf?src-supplier=Element14; ComponentLink10Description: https://datasheet.ciiva.com/7709/94128-7709949.pdf?src-supplier=Element14; ComponentLink11URL: https://datasheet.ciiva.com/2974/tl082-2974257.pdf?src-supplier=Avnet; ComponentLink11Description: https://datasheet.ciiva.com/2974/tl082-2974257.pdf?src-supplier=Avnet
U4 = CMP-0188-01065-1: 10-Bit DACs with Internal VREF and SPI Interface, 8-Pin PDIP, Extended Temperature; Input Offset Voltage (Vos): 820uV; Interface: SPI,Serial; Number of Channels: 2; Operating Supply Voltage: 5.5V; Min Supply Voltage: 2.7V; Max Supply Voltage: 6.5V; Nominal Supply Current: 415uA; Settling Time: 4.5us; Number of Bits: 10; Resolution: 10b; Integral Nonlinearity (INL): 3.5LSB; Output Type: Voltage; Polarity: Bipolar; Supply Type: Single; Reference Voltage: 2.048V; ComponentLink1Description: Manufacturer URL; ComponentLink3URL: http://www.microchip.com/stellent/groups/techpub_sg/documents/packagingspec/en012702.pdf; PackageDescription: 8-Lead Plastic Dual In-Line (P) - 300 mil Body [PDIP]; DatasheetVersion: revA, Apr-2010; ComponentLink2URL: http://ww1.microchip.com/downloads/en/DeviceDoc/22249A.pdf; PackageVersion: revBB, Aug-2009; ComponentLink3Description: Package Specification; PackageReference: PDIP300-P8; ComponentLink2Description: Datasheet; ComponentLink1URL: http://www.microchip.com/; Code_JEDEC: MS-001; RoHS: Yes; Category: Digital to Analog Converters (DACs); Stock 1: 82; Pricing 1: 1=2.11000, 25=1.76000, 100=1.60000 (USD); Mount: Through Hole; Case/Package: PDIP; Number of Pins: 8; Min Operating Temperature: -40°C; Max Operating Temperature: 125°C; Packaging: Rail/Tube; Number of DAC Channels: 2; Package Quantity: 60; Number of Converters: 2; Length: 10.16mm; Height: 4.95mm; Width: 7.11mm; Radiation Hardening: No; Lead Free: Lead Free; ComponentLink4URL: https://datasheet.ciiva.com/41459/001083272-da-01-en-dac-10b-spi-vref-mcp4812-e-p-pdip-8-mcp-41459029.pdf?src-supplier=Conrad; ComponentLink4Description: https://datasheet.ciiva.com/41459/001083272-da-01-en-dac-10b-spi-vref-mcp4812-e-p-pdip-8-mcp-41459029.pdf?src-supplier=Conrad; ComponentLink5URL: https://datasheet.ciiva.com/3041/22249a-3041497.pdf?src-supplier=Avnet; ComponentLink5Description: https://datasheet.ciiva.com/3041/22249a-3041497.pdf?src-supplier=Avnet; ComponentLink6URL: https://datasheet.ciiva.com/6666/22249a-6666538.pdf?src-supplier=Digi-Key; ComponentLink6Description: https://datasheet.ciiva.com/6666/22249a-6666538.pdf?src-supplier=Digi-Key; ComponentLink7URL: https://datasheet.ciiva.com/16625/22249a-16625662.pdf?src-supplier=Avnet+Europe; ComponentLink7Description: https://datasheet.ciiva.com/16625/22249a-16625662.pdf?src-supplier=Avnet+Europe
Y1 = CMP-27762-000017-1: MEMS OSC XO 25.0000MHZ CMOS SMD; Manufacturer Part Number: ASEMB-25.000MHZ-LC-T; Manufacturer: Abracon; Load Capacitance: 15pF; Min Supply Voltage: 1.8V; Max Supply Current: 15mA; Stability: 50ppm; Frequency: 25MHz; Max Junction Temp: +150°C; Max Supply Voltage: 3.3V; Category: Crys; Package: ASEMB; Series: ASEMB; Footprint Url: https://abracon.com/Support/PackageDrawing/Oscillators/ASEMB.PDF; ComponentLink2URL: https://abracon.com/Oscillators/ASEMB.pdf; Temperature Range Low: -40°C; Device Class L1: Passive Components; Device Class L3: Oscillators; ComponentLink2Description: Datasheet; RoHS: TRUE; Automotive: No; Mouser Description: Standard Clock Oscillators 25.000MHZ 50ppm -40 + 85C; Device Class L2: Crystals / Oscillators; Temperature Range High: +85°C; Temperature: -40°C to +85°C; Lead Free: Yes; Octopart: https://octopart.com/asemb-25.000mhz-lc-t-abracon-21704580; Digikey Description: MEMS OSC XO 25.0000MHZ CMOS SMD; Height: 0.9mm